# Altium schematic sheet fridge_module.SchDoc
size A4
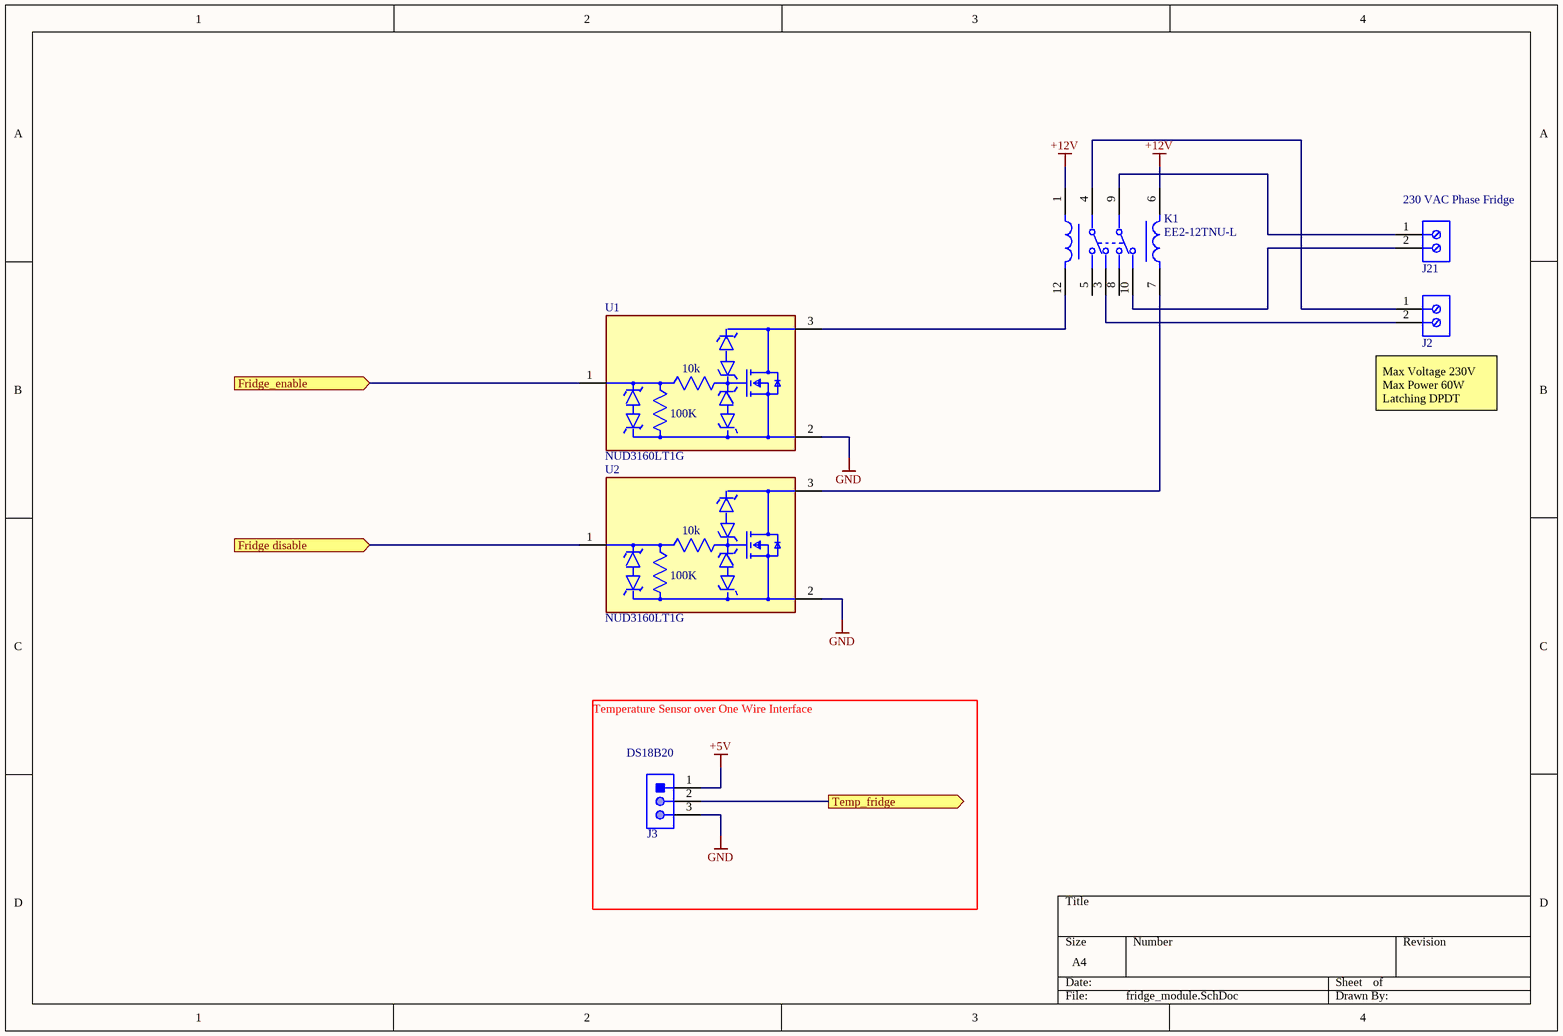
[diagram p0: fridge_module.SchDoc]

## Parts
J2  282836-2  [TECO-282836-2_V]  (value not drawn)
J3  JST-S3B-PH-SM4-TB-3_V  [JST-S3B-PH-SM4-TB-3_V]  (value not drawn)
J21  282836-2  [TECO-282836-2_V]  (value not drawn)
K1  EE2-12TNU-L  [FP-EE2-12TNU-L-MFG]
U1  NUD3160LT1G  [FP-318-08-MFG]
U2  NUD3160LT1G  [FP-318-08-MFG]

## Ports
Fridge disable (in), Fridge_enable (in), Temp_fridge (out)

## Nets
+5V: J3.1
+12V: K1.1(SET+) K1.6(RESET+)
GND: J3.3 U1.2(Source) U2.2(Source)
Fridge disable: U2.1(Gate) ; port Fridge disable
Fridge_enable: U1.1(Gate) ; port Fridge_enable
Temp_fridge: J3.2 ; port Temp_fridge
NetJ2_1: J2.1 K1.4
NetJ2_2: J2.2 K1.3
NetJ21_1: J21.1 K1.9
NetJ21_2: J21.2 K1.10
NetK1_7: K1.7(RESET-) U2.3(Drain)
NetK1_12: K1.12(SET-) U1.3(Drain)

Not connected (* = marked no-connect by the designer): K1 5 8

## Notes on the sheet
- (near J21) 230 VAC Phase Fridge
- (near J2) Max Voltage 230V
  Max Power 60W
  Latching DPDT
- (near J3) DS18B20
- (near J3) Temperature Sensor over One Wire Interface
- (in symbol CMP-07123-000002-1) 10k; 100K

## Library data of the parts
J2 J21 = CMP-1684-00017-1: Female Header, Pitch 5 mm, 1 x 2 Position, Height 10 mm, Tail Length 3.5 mm, Rohs, Bulk; Manufacturer: TE Connectivity; Wire Gauge: 16-30AWG; Product Training Modules: Wire-to-BoardEurostyleTerminalBlocks; Clamp Material - Plating: Brass-NickelPlated; Voltage: 300V; Mating Orientation: HorizontalwithBoard; Current: 13.5A; Pitch: 0.197"(5.00mm); Screw Thread: M3; 3D Model: 282836-2.pdf; Other Names: 5ULV-02B / A98076; Dynamic Catalog: BuchananSeries; Number of Levels: 1; Torque - Screw: 0.68Nm(6Lb-In); Featured Product: EurostyleTerminalBlockConnectors; Positions Per Level: 2; Wire Termination: Screw-RisingCageClamp; Datasheet URL: http://www.te.com.cn/commerce/DocumentDelivery/DDEController?Action=showdoc&DocId=Catalog+Section%7F1308389_EUROSTYLE_TERMINAL_BLOCKS%7F0607%7Fpdf%7FEnglish%7FENG_CS_1308389_EUROSTYLE_TERMINAL_BLOCKS_0607.pdf%7F282836-2; Color: Green; Family: TerminalBlocks-WiretoBoard; RoHS Information: 282836-2StatementofCompliance; Standard Package: 300; Contact Material - Plating: Brass-TinPlated; Manufacturer URL: http://www.te.com; Housing Material: Polyamide(PA66),Nylon6/6; Features: Interlocking(Side); Package Description: Female Header, Pitch 5 mm, 1 x 2 Position, Height 10 mm, Tail Length 3.5 mm; Mounting Type: ThroughHole; Package Reference: THD; Packaging: Bulk; Series: Buchanan; Category: Connectors,Interconnects; Screw Material - Plating: Brass-NickelPlated
J3 = CONNECTOR_JST-S3B-PH-SM4
K1 = CMP-03195-000019-1: RELAY GEN PURPOSE DPDT 2A 12VDC; Coil Power: 140mW; Operate Time: 2ms; Release Time: 1ms; Relay Type: General Purpose; Max Voltage Rating (DC): 220V; Coil Current: 11.7mA; Coil Type: Latching, Dual Coil; Coil Voltage (DC): 12V; Coil Resistance: 1.028kR; Max Voltage Rating (AC): 250V; Number of Poles: 1; Length: 15mm; Contact Current Rating: 2A; Height: 9mm; Radiation Hardening: No; Package Quantity: 500; Throw Configuration: DPDT; Max Operating Temperature: 85°C; REACH SVHC: No SVHC; Current Rating: 2A; Number of Pins: 10; Packaging: Tape and Reel; Power Consumption: 140mW; Termination: Gull Wing; RoHS Compliant: Yes; Mount: Surface Mount; Max Current Rating: 2A; Min Operating Temperature: -40°C; Contact Material: Gold; Depth: 7.5mm
U1 U2 = CMP-07123-000002-1: IC INDCT LOAD DRVR INDUST SOT23; Manufacturer: ON Semiconductor; Max Power Dissipation: 225mW; Fall Time: 622ns; Max Supply Voltage: 60V; Propagation Delay: 1160ns; Output Current: 150mA; Output Voltage: 48V; Standoff Height: 0.01mm; Number Of Outputs: 1; Max Junction Temp: +150°C; Rise Time: 600ns; Temperature Range Low: -40°C; Mouser Description: MOSFET 61V Industrial Load Driver; Ambient Temperature Range High: +125°C; Octopart: https://octopart.com/nud3160lt1g-on+semiconductor-470723; Package: 318-08; Automotive: No; Temperature: -40°C to +150°C; RoHS: TRUE; Lead Free: Yes; Height: 1.11mm; Device Class L3: Gate Drivers; Ambient Temperature Range Low: -40°C; Device Class L2: Power Management ICs; Digikey Description: IC INDCT LOAD DRVR INDUST SOT23; Category: IC; Device Class L1: Integrated Circuits (ICs); Manufacturer Part Number: NUD3160LT1G; Footprint Url: https://www.onsemi.com/pub/Collateral/318-08.PDF; Number Of Drivers: 1; ComponentLink2Description: Datasheet; Temperature Range High: +150°C; ComponentLink2URL: https://www.onsemi.com/pub/Collateral/NUD3160-D.PDF